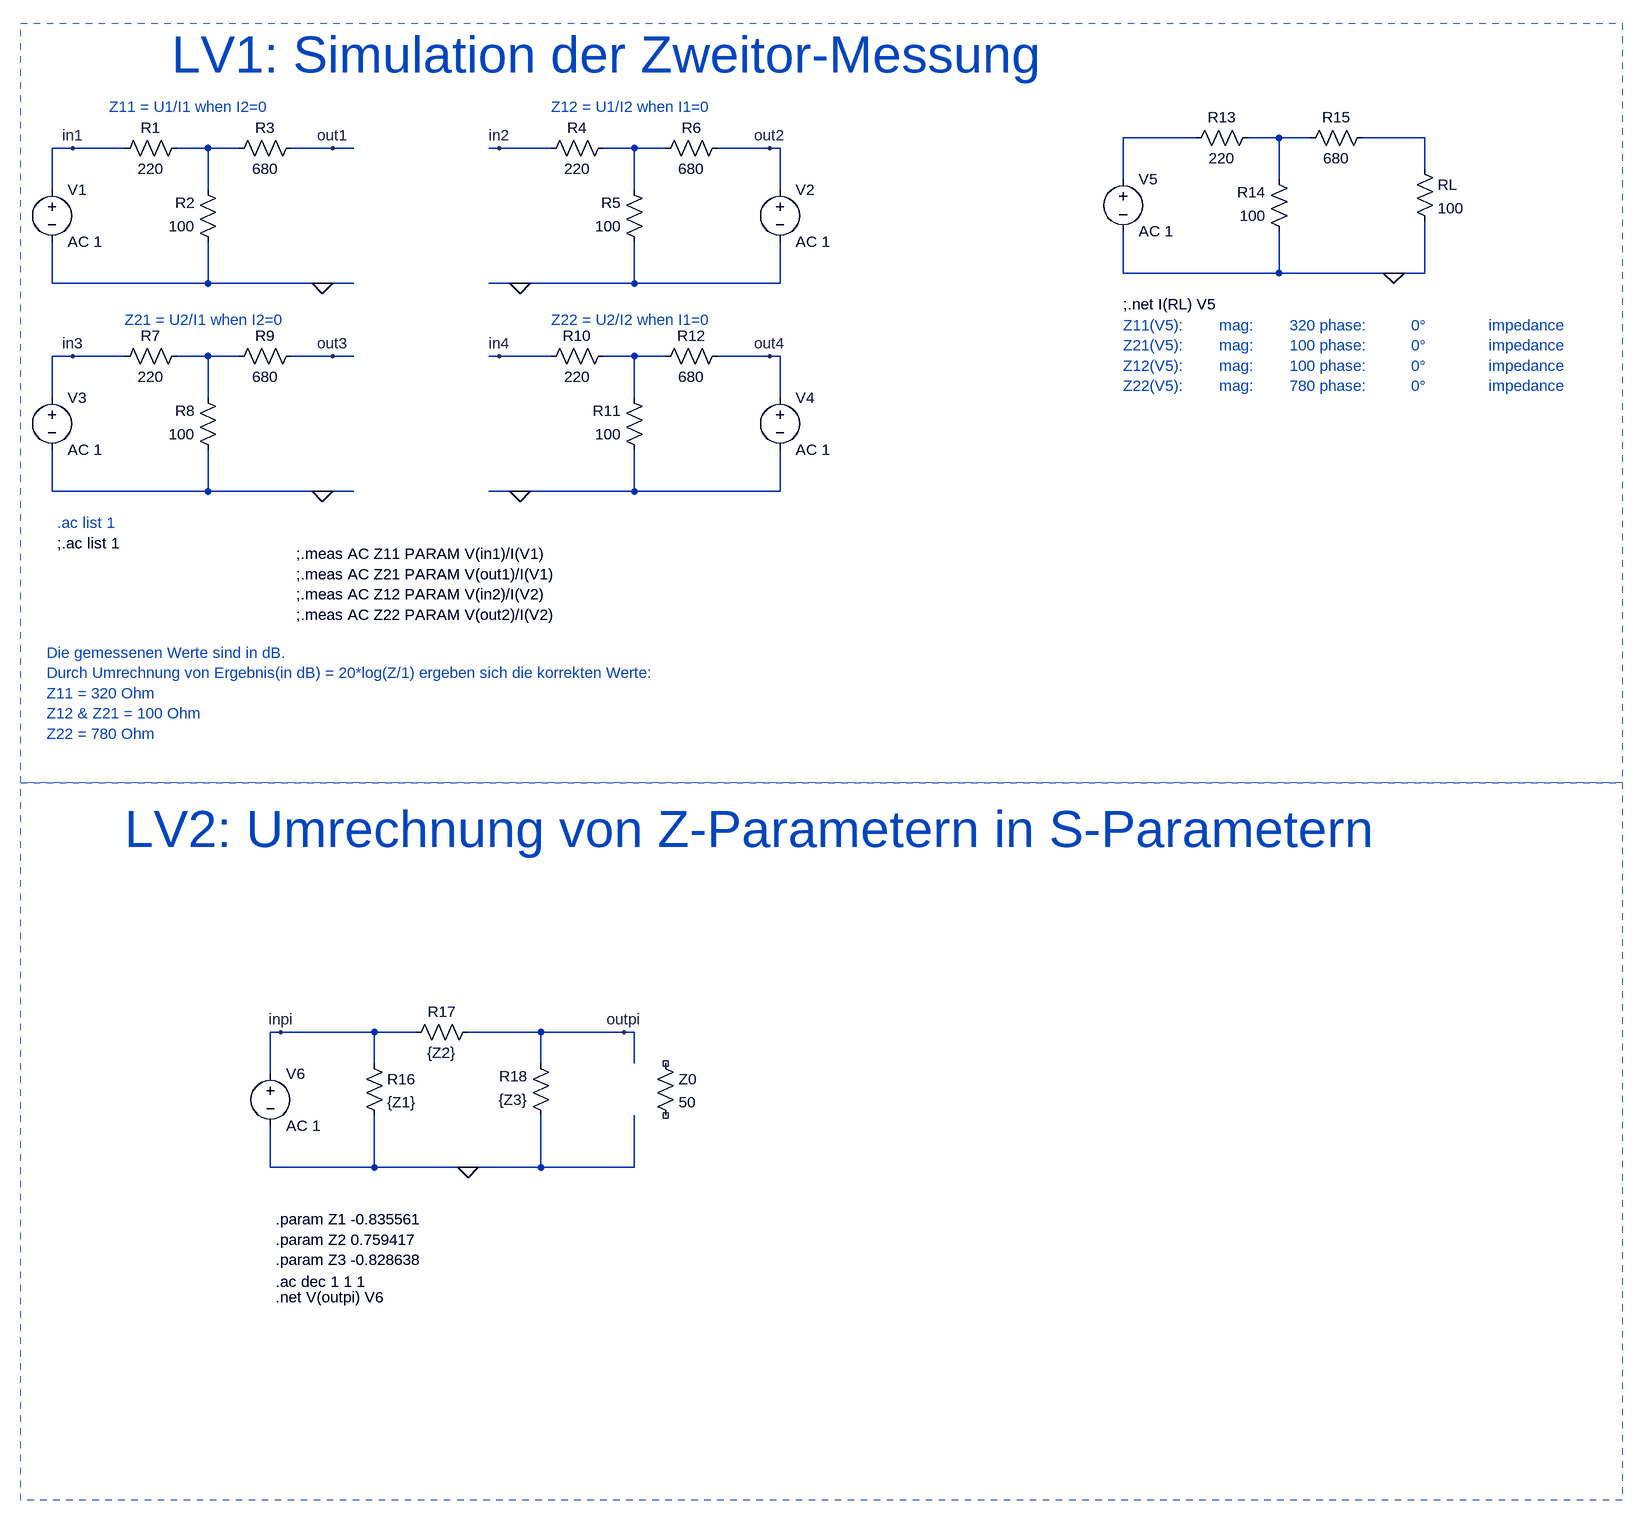
[diagram p0: schematic Laborvorbereitung.asc]
Laborvorbereitung.asc, the LTspice schematic file:
Version 4.1
SHEET 1 3124 2068
WIRE 1776 -32 1664 -32
WIRE 1904 -32 1856 -32
WIRE 1952 -32 1904 -32
WIRE 2128 -32 2032 -32
WIRE 48 -16 16 -16
WIRE 128 -16 48 -16
WIRE 256 -16 208 -16
WIRE 304 -16 256 -16
WIRE 448 -16 384 -16
WIRE 480 -16 448 -16
WIRE 704 -16 688 -16
WIRE 784 -16 704 -16
WIRE 912 -16 864 -16
WIRE 960 -16 912 -16
WIRE 1120 -16 1040 -16
WIRE 1136 -16 1120 -16
WIRE 2128 16 2128 -32
WIRE 1664 32 1664 -32
WIRE 1904 32 1904 -32
WIRE 16 48 16 -16
WIRE 256 48 256 -16
WIRE 912 48 912 -16
WIRE 1136 48 1136 -16
WIRE 1664 176 1664 112
WIRE 1904 176 1904 112
WIRE 1904 176 1664 176
WIRE 2080 176 1904 176
WIRE 2128 176 2128 96
WIRE 2128 176 2080 176
WIRE 16 192 16 128
WIRE 256 192 256 128
WIRE 256 192 16 192
WIRE 432 192 256 192
WIRE 480 192 432 192
WIRE 736 192 688 192
WIRE 912 192 912 128
WIRE 912 192 736 192
WIRE 1136 192 1136 128
WIRE 1136 192 912 192
WIRE 48 304 16 304
WIRE 128 304 48 304
WIRE 256 304 208 304
WIRE 304 304 256 304
WIRE 448 304 384 304
WIRE 480 304 448 304
WIRE 704 304 688 304
WIRE 784 304 704 304
WIRE 912 304 864 304
WIRE 960 304 912 304
WIRE 1120 304 1040 304
WIRE 1136 304 1120 304
WIRE 16 368 16 304
WIRE 256 368 256 304
WIRE 912 368 912 304
WIRE 1136 368 1136 304
WIRE 16 512 16 448
WIRE 256 512 256 448
WIRE 256 512 16 512
WIRE 432 512 256 512
WIRE 480 512 432 512
WIRE 736 512 688 512
WIRE 912 512 912 448
WIRE 912 512 736 512
WIRE 1136 512 1136 448
WIRE 1136 512 912 512
WIRE 368 1344 352 1344
WIRE 512 1344 368 1344
WIRE 576 1344 512 1344
WIRE 768 1344 656 1344
WIRE 896 1344 768 1344
WIRE 912 1344 896 1344
WIRE 512 1392 512 1344
WIRE 768 1392 768 1344
WIRE 912 1392 912 1344
WIRE 352 1408 352 1344
WIRE 352 1552 352 1488
WIRE 512 1552 512 1472
WIRE 512 1552 352 1552
WIRE 656 1552 512 1552
WIRE 768 1552 768 1472
WIRE 768 1552 656 1552
WIRE 912 1552 912 1472
WIRE 912 1552 768 1552
FLAG 48 -16 in1
FLAG 448 -16 out1
FLAG 1120 -16 out2
FLAG 704 -16 in2
FLAG 48 304 in3
FLAG 448 304 out3
FLAG 1120 304 out4
FLAG 704 304 in4
FLAG 432 192 0
FLAG 432 512 0
FLAG 736 192 0
FLAG 736 512 0
FLAG 2080 176 0
FLAG 656 1552 0
FLAG 368 1344 inpi
FLAG 896 1344 outpi
SYMBOL voltage 16 32 R0
SYMATTR InstName V1
SYMATTR Value AC 1
SYMBOL voltage 1136 32 R0
SYMATTR InstName V2
SYMATTR Value AC 1
SYMBOL res 224 -32 R90
WINDOW 0 0 56 VBottom 2
WINDOW 3 32 56 VTop 2
SYMATTR InstName R1
SYMATTR Value 220
SYMBOL res 272 144 R180
WINDOW 0 36 76 Left 2
WINDOW 3 36 40 Left 2
SYMATTR InstName R2
SYMATTR Value 100
SYMBOL res 288 0 R270
WINDOW 0 32 56 VTop 2
WINDOW 3 0 56 VBottom 2
SYMATTR InstName R3
SYMATTR Value 680
SYMBOL res 880 -32 R90
WINDOW 0 0 56 VBottom 2
WINDOW 3 32 56 VTop 2
SYMATTR InstName R4
SYMATTR Value 220
SYMBOL res 928 144 R180
WINDOW 0 36 76 Left 2
WINDOW 3 36 40 Left 2
SYMATTR InstName R5
SYMATTR Value 100
SYMBOL res 944 0 R270
WINDOW 0 32 56 VTop 2
WINDOW 3 0 56 VBottom 2
SYMATTR InstName R6
SYMATTR Value 680
SYMBOL voltage 16 352 R0
SYMATTR InstName V3
SYMATTR Value AC 1
SYMBOL voltage 1136 352 R0
SYMATTR InstName V4
SYMATTR Value AC 1
SYMBOL res 224 288 R90
WINDOW 0 0 56 VBottom 2
WINDOW 3 32 56 VTop 2
SYMATTR InstName R7
SYMATTR Value 220
SYMBOL res 272 464 R180
WINDOW 0 36 76 Left 2
WINDOW 3 36 40 Left 2
SYMATTR InstName R8
SYMATTR Value 100
SYMBOL res 288 320 R270
WINDOW 0 32 56 VTop 2
WINDOW 3 0 56 VBottom 2
SYMATTR InstName R9
SYMATTR Value 680
SYMBOL res 880 288 R90
WINDOW 0 0 56 VBottom 2
WINDOW 3 32 56 VTop 2
SYMATTR InstName R10
SYMATTR Value 220
SYMBOL res 928 464 R180
WINDOW 0 36 76 Left 2
WINDOW 3 36 40 Left 2
SYMATTR InstName R11
SYMATTR Value 100
SYMBOL res 944 320 R270
WINDOW 0 32 56 VTop 2
WINDOW 3 0 56 VBottom 2
SYMATTR InstName R12
SYMATTR Value 680
SYMBOL voltage 1664 16 R0
SYMATTR InstName V5
SYMATTR Value AC 1
SYMBOL res 1872 -48 R90
WINDOW 0 0 56 VBottom 2
WINDOW 3 32 56 VTop 2
SYMATTR InstName R13
SYMATTR Value 220
SYMBOL res 1920 128 R180
WINDOW 0 36 76 Left 2
WINDOW 3 36 40 Left 2
SYMATTR InstName R14
SYMATTR Value 100
SYMBOL res 1936 -16 R270
WINDOW 0 32 56 VTop 2
WINDOW 3 0 56 VBottom 2
SYMATTR InstName R15
SYMATTR Value 680
SYMBOL res 2112 0 R0
SYMATTR InstName RL
SYMATTR Value 100
SYMBOL res 496 1376 R0
SYMATTR InstName R16
SYMATTR Value {Z1}
SYMBOL res 672 1328 R90
WINDOW 0 0 56 VBottom 2
WINDOW 3 32 56 VTop 2
SYMATTR InstName R17
SYMATTR Value {Z2}
SYMBOL res 784 1488 R180
WINDOW 0 36 76 Left 2
WINDOW 3 36 40 Left 2
SYMATTR InstName R18
SYMATTR Value {Z3}
SYMBOL voltage 352 1392 R0
SYMATTR InstName V6
SYMATTR Value AC 1
SYMBOL res 944 1376 R0
SYMATTR InstName Z0
SYMATTR Value 50
TEXT 104 -80 Left 2 ;Z11 = U1/I1 when I2=0
TEXT 784 -80 Left 2 ;Z12 = U1/I2 when I1=0
TEXT 128 248 Left 2 ;Z21 = U2/I1 when I2=0
TEXT 784 248 Left 2 ;Z22 = U2/I2 when I1=0
TEXT 392 608 Left 2 !;.meas AC Z11 PARAM V(in1)/I(V1)\n;.meas AC Z21 PARAM V(out1)/I(V1)\n;.meas AC Z12 PARAM V(in2)/I(V2)\n;.meas AC Z22 PARAM V(out2)/I(V2)
TEXT 24 560 Left 2 ;.ac list 1
TEXT 8 760 Left 2 ;Die gemessenen Werte sind in dB.\nDurch Umrechnung von Ergebnis(in dB) = 20*log(Z/1) ergeben sich die korrekten Werte:\nZ11 = 320 Ohm\nZ12 & Z21 = 100 Ohm\nZ22 = 780 Ohm
TEXT 1664 224 Left 2 !;.net I(RL) V5
TEXT 1664 256 Left 2 ;Z11(V5):        mag:        320 phase:          0°              impedance\nZ21(V5):        mag:        100 phase:          0°              impedance\nZ12(V5):        mag:        100 phase:          0°              impedance\nZ22(V5):        mag:        780 phase:          0°              impedance
TEXT 200 -160 Left 6 ;LV1: Simulation der Zweitor-Messung
TEXT 360 1632 Left 2 !.param Z1 -0.835561\n.param Z2 0.759417\n.param Z3 -0.828638
TEXT 360 1728 Left 2 !.ac dec 1 1 1
TEXT 24 592 Left 2 !;.ac list 1
TEXT 360 1752 Left 2 !.net V(outpi) V6
TEXT 128 1032 Left 6 ;LV2: Umrechnung von Z-Parametern in S-Parametern
RECTANGLE Normal 2432 960 -32 -208 2
RECTANGLE Normal 2432 2064 -32 960 2

The netlist it stands for:
* Laborvorbereitung.asc
V1 in1 0 AC 1
V2 out2 0 AC 1
R1 N004 in1 220
R2 0 N004 100
R3 N004 out1 680
R4 N005 in2 220
R5 0 N005 100
R6 N005 out2 680
V3 in3 0 AC 1
V4 out4 0 AC 1
R7 N006 in3 220
R8 0 N006 100
R9 N006 out3 680
R10 N007 in4 220
R11 0 N007 100
R12 N007 out4 680
V5 N001 0 AC 1
R13 N002 N001 220
R14 0 N002 100
R15 N002 N003 680
RL N003 0 100
R16 inpi 0 {Z1}
R17 outpi inpi {Z2}
R18 0 outpi {Z3}
V6 inpi 0 AC 1
R§Z0 NC_01 NC_02 50
* Z11 = U1/I1 when I2=0
* Z12 = U1/I2 when I1=0
* Z21 = U2/I1 when I2=0
* Z22 = U2/I2 when I1=0
;.meas AC Z11 PARAM V(in1)/I(V1)
;.meas AC Z21 PARAM V(out1)/I(V1)
;.meas AC Z12 PARAM V(in2)/I(V2)
;.meas AC Z22 PARAM V(out2)/I(V2)
* .ac list 1
* Die gemessenen Werte sind in dB.
* Durch Umrechnung von Ergebnis(in dB) = 20*log(Z/1) ergeben sich die korrekten Werte:
* Z11 = 320 Ohm
* Z12 & Z21 = 100 Ohm
* Z22 = 780 Ohm
;.net I(RL) V5
* Z11(V5):        mag:        320 phase:          0°              impedance
* Z21(V5):        mag:        100 phase:          0°              impedance
* Z12(V5):        mag:        100 phase:          0°              impedance
* Z22(V5):        mag:        780 phase:          0°              impedance
* LV1: Simulation der Zweitor-Messung
.param Z1 -0.835561
.param Z2 0.759417
.param Z3 -0.828638
.ac dec 1 1 1
;.ac list 1
.net V(outpi) V6
* LV2: Umrechnung von Z-Parametern in S-Parametern
.backanno
.end